# EAGLE design RGB LED 1.1 POV (EAGLE 5.04)
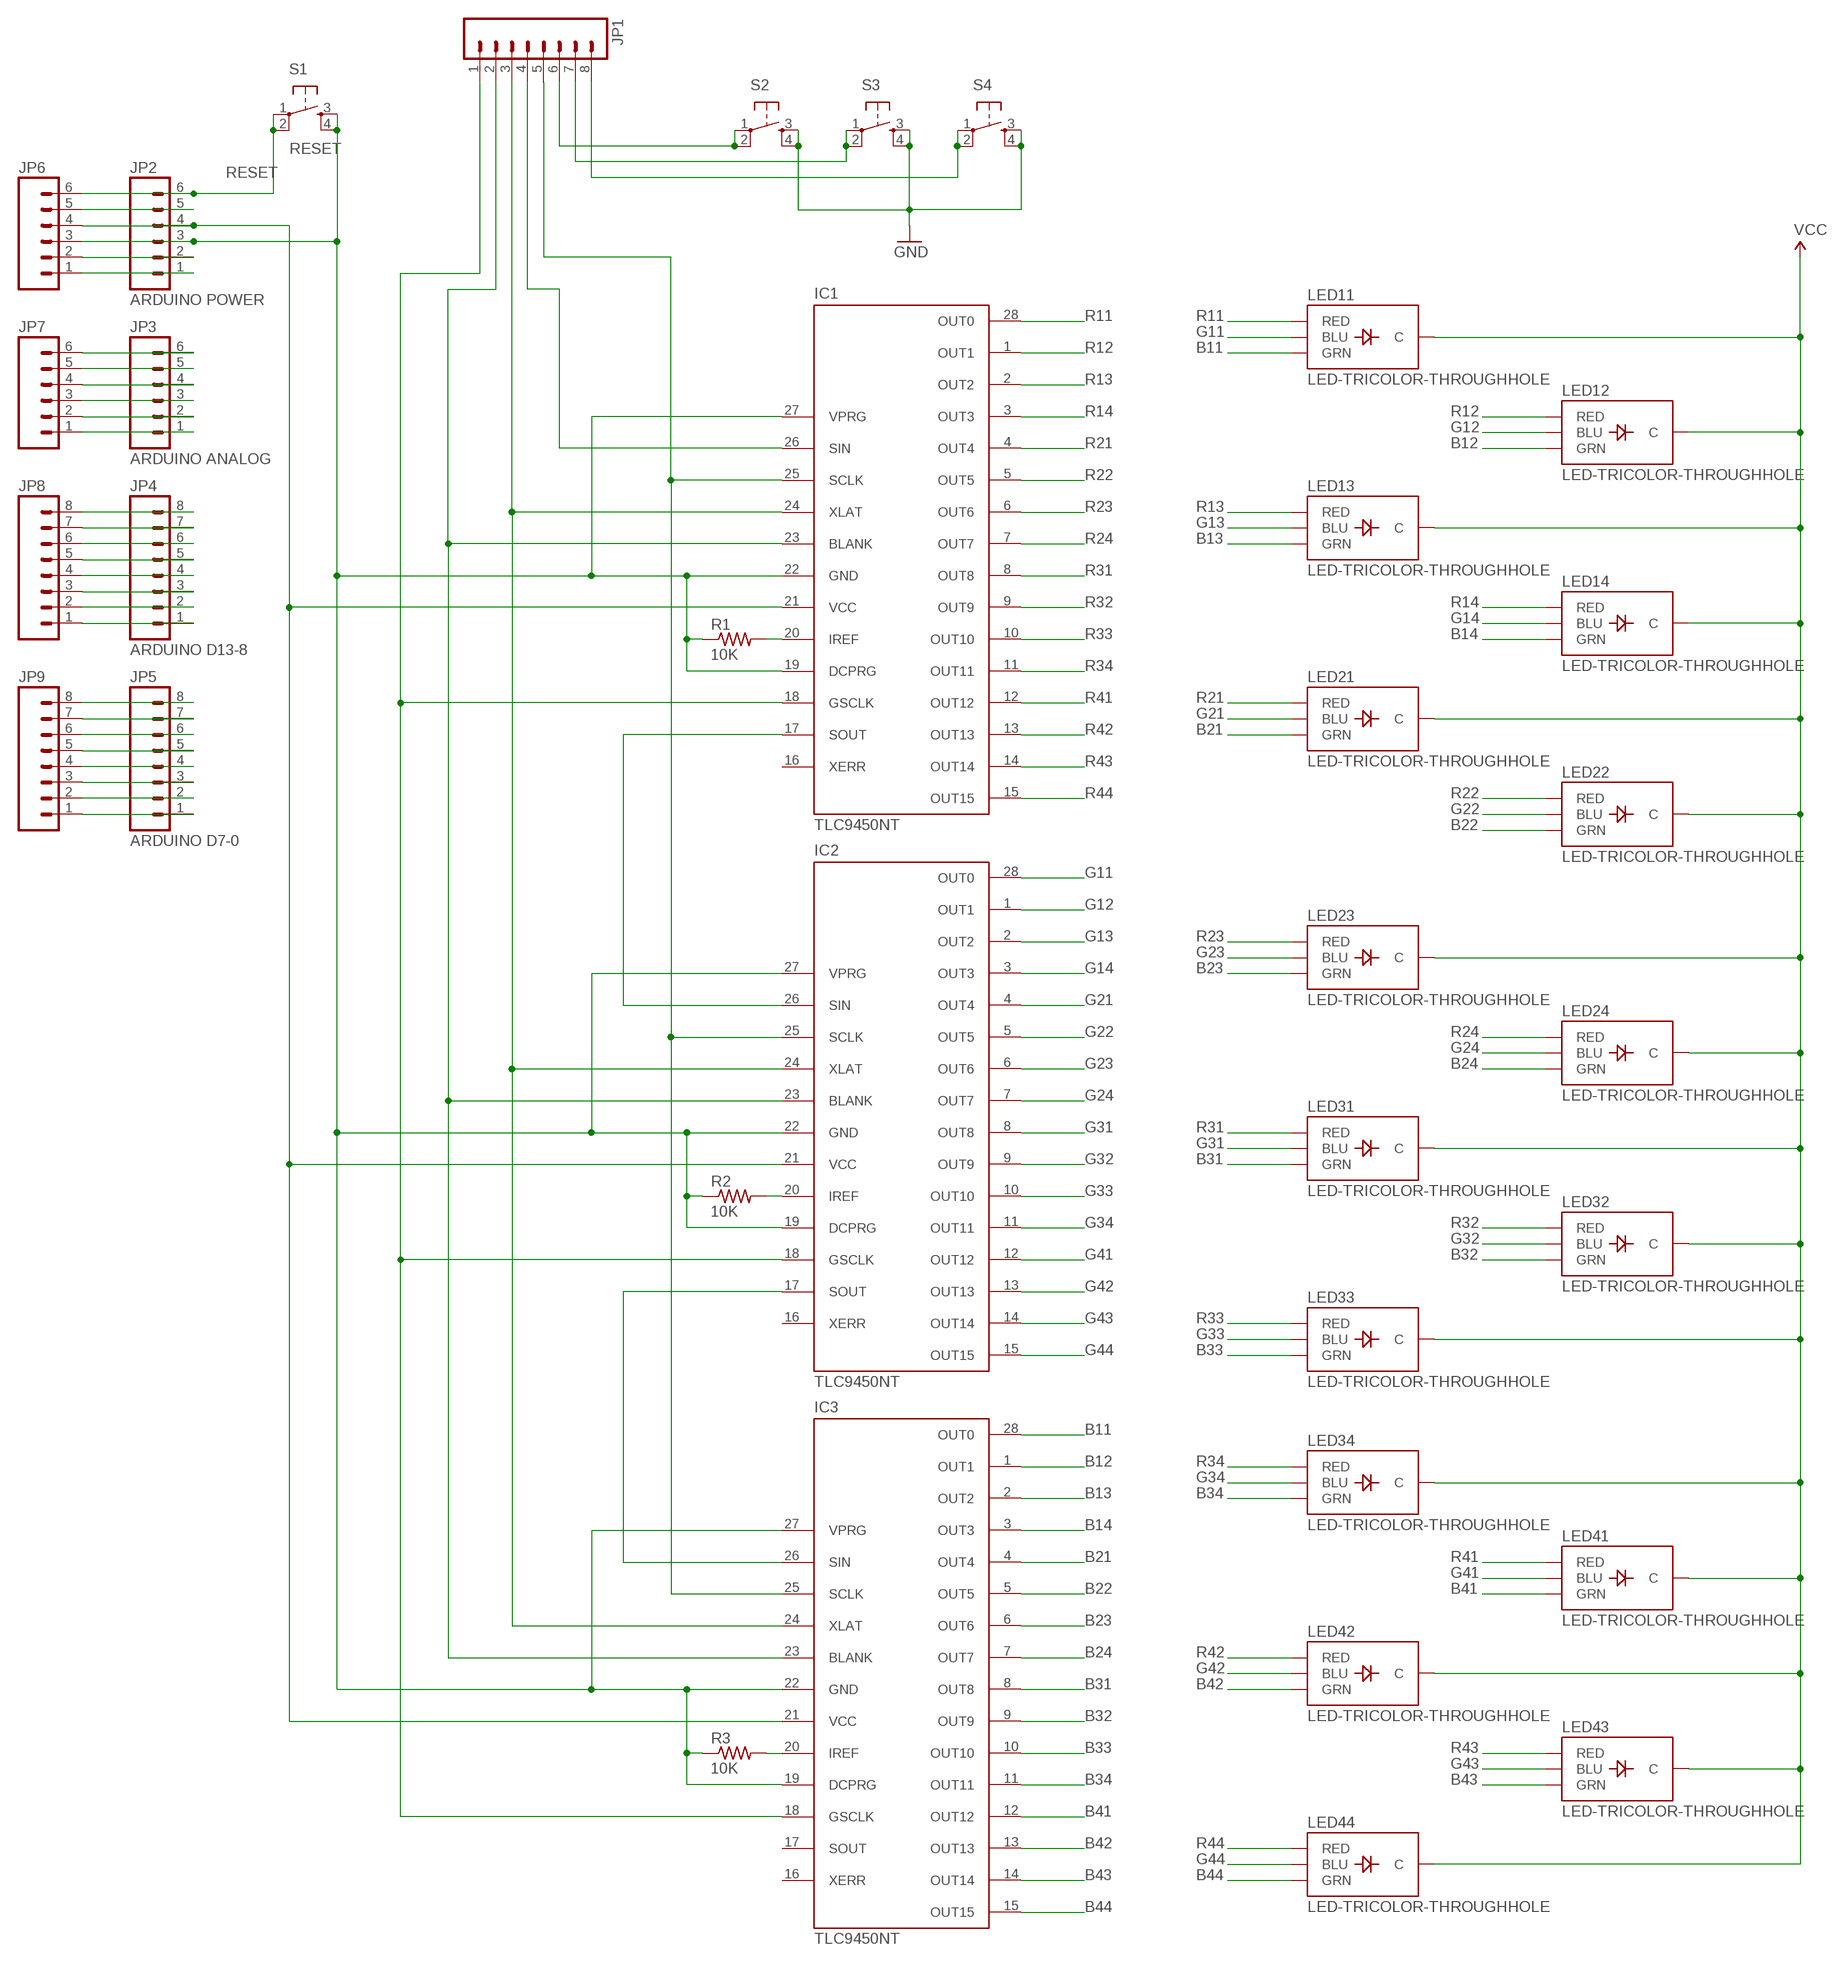
[diagram p0: schematic, sheet 1]

## Parts
IC1  TLC9450NT  [DIL28-3]
IC2  TLC9450NT  [DIL28-3]
IC3  TLC9450NT  [DIL28-3]
JP1  M08LOCK  [1X08_LOCK]
JP2  ARDUINO POWER  M06LOCK  [1X06_LOCK]
JP3  ARDUINO ANALOG  M06LOCK  [1X06_LOCK]
JP4  ARDUINO D13-8  M08LOCK  [1X08_LOCK]
JP5  ARDUINO D7-0  M08LOCK  [1X08_LOCK]
JP6  M06LOCK  [1X06_LOCK]
JP7  M06LOCK  [1X06_LOCK]
JP8  M08LOCK  [1X08_LOCK]
JP9  M08LOCK  [1X08_LOCK]
LED11  LED-TRICOLOR-THROUGHHOLE  [LED-TRICOLOR-THROUGHHOLE]
LED12  LED-TRICOLOR-THROUGHHOLE  [LED-TRICOLOR-THROUGHHOLE]
LED13  LED-TRICOLOR-THROUGHHOLE  [LED-TRICOLOR-THROUGHHOLE]
LED14  LED-TRICOLOR-THROUGHHOLE  [LED-TRICOLOR-THROUGHHOLE]
LED21  LED-TRICOLOR-THROUGHHOLE  [LED-TRICOLOR-THROUGHHOLE]
LED22  LED-TRICOLOR-THROUGHHOLE  [LED-TRICOLOR-THROUGHHOLE]
LED23  LED-TRICOLOR-THROUGHHOLE  [LED-TRICOLOR-THROUGHHOLE]
LED24  LED-TRICOLOR-THROUGHHOLE  [LED-TRICOLOR-THROUGHHOLE]
LED31  LED-TRICOLOR-THROUGHHOLE  [LED-TRICOLOR-THROUGHHOLE]
LED32  LED-TRICOLOR-THROUGHHOLE  [LED-TRICOLOR-THROUGHHOLE]
LED33  LED-TRICOLOR-THROUGHHOLE  [LED-TRICOLOR-THROUGHHOLE]
LED34  LED-TRICOLOR-THROUGHHOLE  [LED-TRICOLOR-THROUGHHOLE]
LED41  LED-TRICOLOR-THROUGHHOLE  [LED-TRICOLOR-THROUGHHOLE]
LED42  LED-TRICOLOR-THROUGHHOLE  [LED-TRICOLOR-THROUGHHOLE]
LED43  LED-TRICOLOR-THROUGHHOLE  [LED-TRICOLOR-THROUGHHOLE]
LED44  LED-TRICOLOR-THROUGHHOLE  [LED-TRICOLOR-THROUGHHOLE]
R1  10K  R-US_0309/12  [0309/12]
R2  10K  R-US_0309/12  [0309/12]
R3  10K  R-US_0309/12  [0309/12]
S1  RESET  TAC_SWITCHPTH  [TACTILE-PTH]
S2  TAC_SWITCHPTH  [TACTILE-PTH]
S3  TAC_SWITCHPTH  [TACTILE-PTH]
S4  TAC_SWITCHPTH  [TACTILE-PTH]

## Nets
B11: IC3.28(OUT0) LED11.GRN
B12: IC3.1(OUT1) LED12.GRN
B13: IC3.2(OUT2) LED13.GRN
B14: IC3.3(OUT3) LED14.GRN
B21: IC3.4(OUT4) LED21.GRN
B22: IC3.5(OUT5) LED22.GRN
B23: IC3.6(OUT6) LED23.GRN
B24: IC3.7(OUT7) LED24.GRN
B31: IC3.8(OUT8) LED31.GRN
B32: IC3.9(OUT9) LED32.GRN
B33: IC3.10(OUT10) LED33.GRN
B34: IC3.11(OUT11) LED34.GRN
B41: IC3.12(OUT12) LED41.GRN
B42: IC3.13(OUT13) LED42.GRN
B43: IC3.14(OUT14) LED43.GRN
B44: IC3.15(OUT15) LED44.GRN
BLANK: IC1.23(BLANK) IC2.23(BLANK) IC3.23(BLANK) JP1.2
G11: IC2.28(OUT0) LED11.BLU
G12: IC2.1(OUT1) LED12.BLU
G13: IC2.2(OUT2) LED13.BLU
G14: IC2.3(OUT3) LED14.BLU
G21: IC2.4(OUT4) LED21.BLU
G22: IC2.5(OUT5) LED22.BLU
G23: IC2.6(OUT6) LED23.BLU
G24: IC2.7(OUT7) LED24.BLU
G31: IC2.8(OUT8) LED31.BLU
G32: IC2.9(OUT9) LED32.BLU
G33: IC2.10(OUT10) LED33.BLU
G34: IC2.11(OUT11) LED34.BLU
G41: IC2.12(OUT12) LED41.BLU
G42: IC2.13(OUT13) LED42.BLU
G43: IC2.14(OUT14) LED43.BLU
G44: IC2.15(OUT15) LED44.BLU
GND: IC1.19(DCPRG) IC1.22(GND) IC1.27(VPRG) IC2.19(DCPRG) IC2.22(GND) IC2.27(VPRG) IC3.19(DCPRG) IC3.22(GND) IC3.27(VPRG) JP2.3 JP6.3 R1.1 R2.1 R3.1 S1.3 S1.4 S2.3 S2.4 S3.3 S3.4 S4.3 S4.4
GSCLK: IC1.18(GSCLK) IC2.18(GSCLK) IC3.18(GSCLK) JP1.1
N$1: IC1.17(SOUT) IC2.26(SIN)
N$2: IC2.17(SOUT) IC3.26(SIN)
N$3: JP1.6 S2.1 S2.2
N$4: IC3.20(IREF) R3.2
N$5: IC2.20(IREF) R2.2
N$6: IC1.20(IREF) R1.2
N$7: JP2.5 JP6.5
N$8: JP2.2 JP6.2
N$9: JP2.1 JP6.1
N$10: JP3.6 JP7.6
N$11: JP3.5 JP7.5
N$12: JP3.4 JP7.4
N$13: JP3.3 JP7.3
N$14: JP3.2 JP7.2
N$15: JP3.1 JP7.1
N$16: JP4.8 JP8.8
N$17: JP4.7 JP8.7
N$18: JP4.6 JP8.6
N$19: JP4.5 JP8.5
N$20: JP4.4 JP8.4
N$21: JP4.3 JP8.3
N$22: JP4.2 JP8.2
N$23: JP4.1 JP8.1
N$24: JP5.8 JP9.8
N$25: JP5.7 JP9.7
N$26: JP5.6 JP9.6
N$27: JP5.5 JP9.5
N$28: JP5.4 JP9.4
N$29: JP5.3 JP9.3
N$30: JP5.2 JP9.2
N$31: JP5.1 JP9.1
N$32: JP1.7 S3.1 S3.2
N$33: JP1.8 S4.1 S4.2
R11: IC1.28(OUT0) LED11.RED
R12: IC1.1(OUT1) LED12.RED
R13: IC1.2(OUT2) LED13.RED
R14: IC1.3(OUT3) LED14.RED
R21: IC1.4(OUT4) LED21.RED
R22: IC1.5(OUT5) LED22.RED
R23: IC1.6(OUT6) LED23.RED
R24: IC1.7(OUT7) LED24.RED
R31: IC1.8(OUT8) LED31.RED
R32: IC1.9(OUT9) LED32.RED
R33: IC1.10(OUT10) LED33.RED
R34: IC1.11(OUT11) LED34.RED
R41: IC1.12(OUT12) LED41.RED
R42: IC1.13(OUT13) LED42.RED
R43: IC1.14(OUT14) LED43.RED
R44: IC1.15(OUT15) LED44.RED
RESET: JP2.6 JP6.6 S1.1 S1.2
SCLK: IC1.25(SCLK) IC2.25(SCLK) IC3.25(SCLK) JP1.5
SIN: IC1.26(SIN) JP1.4
VCC: IC1.21(VCC) IC2.21(VCC) IC3.21(VCC) JP2.4 JP6.4 LED11.GND(C) LED12.GND(C) LED13.GND(C) LED14.GND(C) LED21.GND(C) LED22.GND(C) LED23.GND(C) LED24.GND(C) LED31.GND(C) LED32.GND(C) LED33.GND(C) LED34.GND(C) LED41.GND(C) LED42.GND(C) LED43.GND(C) LED44.GND(C)
XLAT: IC1.24(XLAT) IC2.24(XLAT) IC3.24(XLAT) JP1.3
Unconnected: IC1.16(XERR) IC2.16(XERR) IC3.16(XERR) IC3.17(SOUT)

## Library data of the parts
IC1-IC3 = combee:TLC9450NT: TI TLC5940 16 Channel LED Driver
JP1 JP4 JP5 JP8 JP9 = SparkFun:M08: Header 8 Standard 8-pin 0.1" header. Use with straight break away headers (SKU : PRT-00116), right angle break away headers (PRT-00553), swiss pins (PRT-00743), machine pins (PRT-00117), and female headers (PRT-00115).
JP2 JP3 JP6 JP7 = SparkFun:M06: Header 6 Standard 6-pin 0.1" header. Use with straight break away headers (SKU : PRT-00116), right angle break away headers (PRT-00553), swiss pins (PRT-00743), machine pins (PRT-00117), and female headers (PRT-00115). Molex polarized connector foot print use with SKU : PRT-08094 with associated crimp pins and housings. NOTES ON THE VARIANTS LOCK and LOCK_LONGPADS... This footprint was designed to help hold the alignment of a through-hole component (i.e. 6-pin header) while soldering it into place. You may notice that each hole has been shifted either up or down by 0.005 of an inch from it's more standard position (which is a perfectly straight line). This slight alteration caused the pins (the squares in the middle) to touch the edges of the holes. Because they are alternating, it causes a "brace" to hold the component in place. 0.005 has proven to be the perfect amount of "off-center" position when using our standard breakaway headers. Although looks a little odd when you look at the bare footprint, once you have a header in there, the alteration is very hard to notice. Also, if you push a header all the way into place, it is covered up entirely on the bottom side. This idea of altering the position of holes to aid alignment will be further integrated into the Sparkfun Library for other footprints. It can help hold any component with 3 or more connection pins.
LED11-LED14 LED21-LED24 LED31-LED34 LED41-LED44 = SparkFun:LED-TRICOLOR-THROUGHHOLE
R1-R3 = resistor:R-US_: RESISTOR, American symbol
S1-S4 = SparkFun:TAC_SWITCH: Momentary Switch Button commonly used for reset or general input. Spark Fun Electronics SKU : COM-00097

## Board
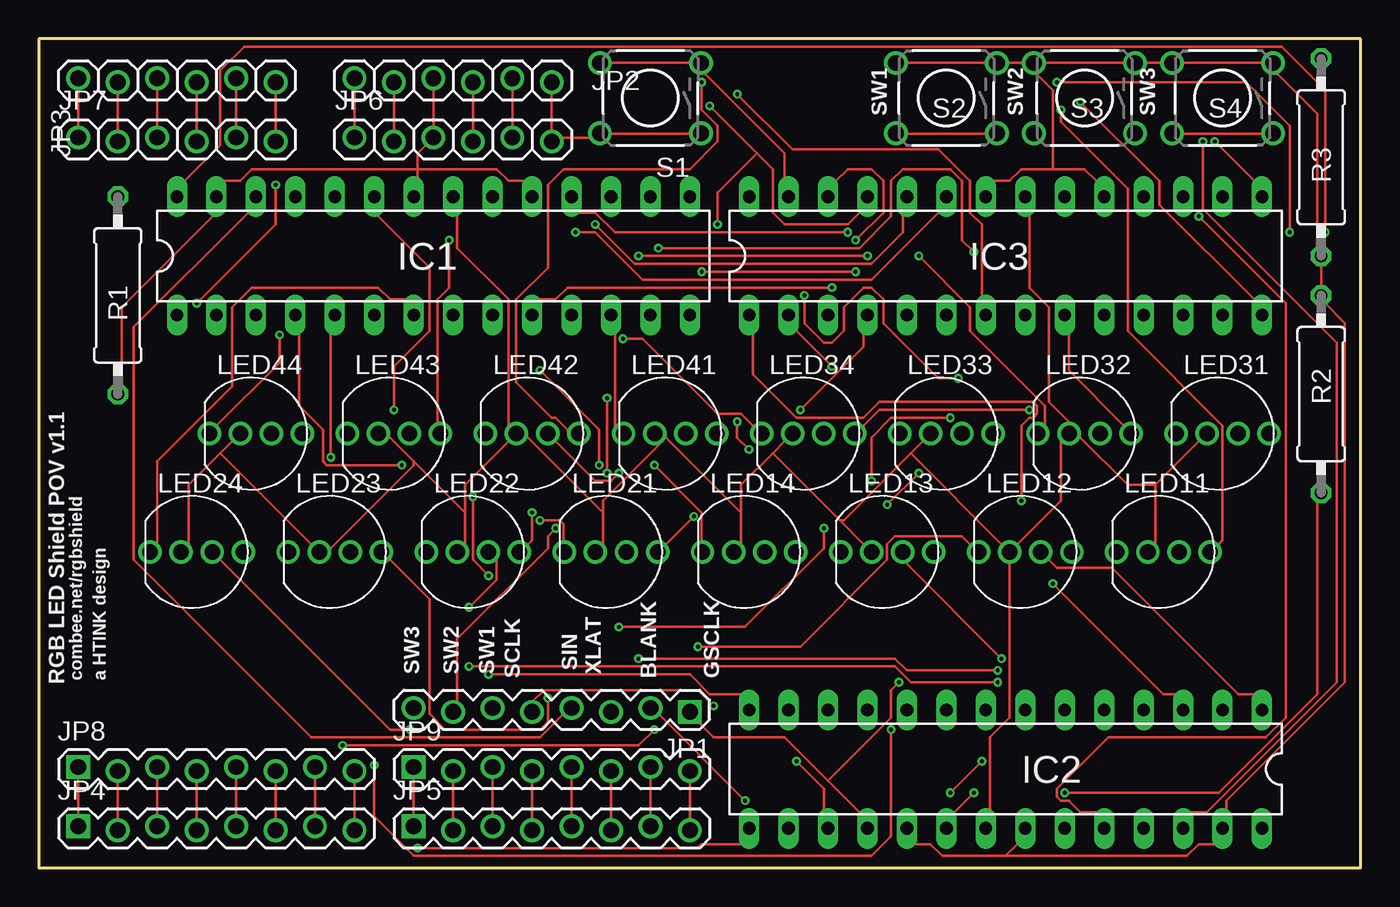
[diagram p1: board, top side]
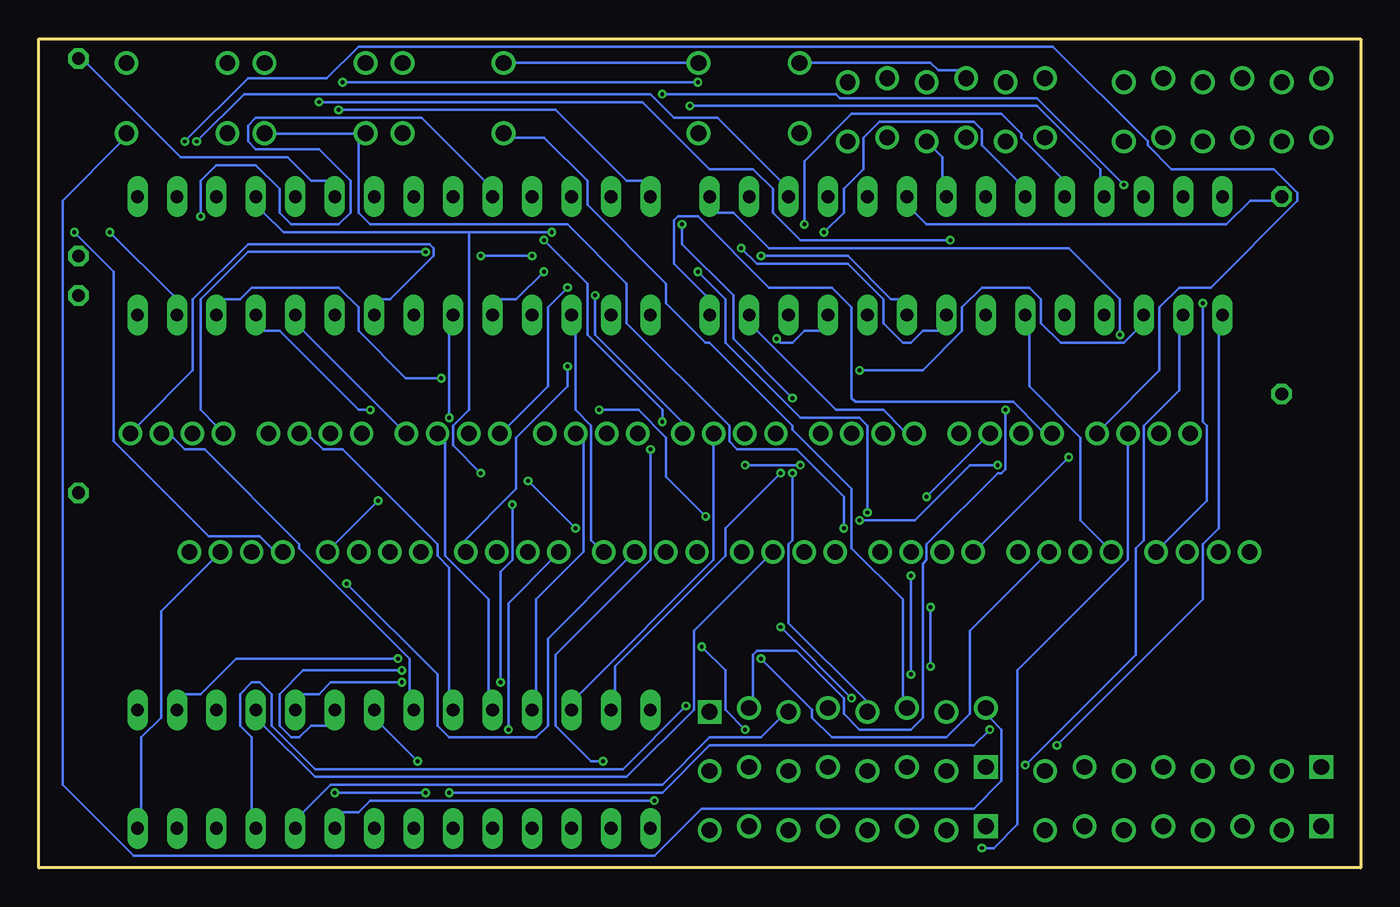
[diagram p2: board, bottom side, seen from below]

Size 85.09 x 53.34 mm. Coordinates in mm from the lower left corner, seen from the top.
Outline: 0,0 85.09,0 85.09,53.34 0,53.34 0,0
Copper layers (1*16): Top 0.035mm / dielectric 1.5mm / Bottom 0.035mm
Design rules "PropagandaPCB": minimum track width 6mil, minimum drill 10mil, track to track 6mil, track to pad 6mil, pad to pad 6mil, via to via 6mil, smd to smd 6mil, copper to edge 10mil, drill to drill 10mil, minimum pad ring 10mil, minimum via ring 6mil, stop-mask expansion 2mil, vias tented up to drill 100mil, thermal gap 10mil

### Footprints (pad centres in the part's own frame; a part is rotated, then mirrored left to right if it is on the bottom)
DIL28-3 = drill 0.813 long: 1 -16.51,-3.81; 2 -13.97,-3.81; 3 -11.43,-3.81; 4 -8.89,-3.81; 5 -6.35,-3.81; 6 -3.81,-3.81; 7 -1.27,-3.81; 8 1.27,-3.81; 9 3.81,-3.81; 10 6.35,-3.81; 11 8.89,-3.81; 12 11.43,-3.81; 13 13.97,-3.81; 14 16.51,-3.81; 15 16.51,3.81; 16 13.97,3.81; 17 11.43,3.81; 18 8.89,3.81; 19 6.35,3.81; 20 3.81,3.81; 21 1.27,3.81; 22 -1.27,3.81; 23 -3.81,3.81; 24 -6.35,3.81; 25 -8.89,3.81; 26 -11.43,3.81; 27 -13.97,3.81; 28 -16.51,3.81
1X08_LOCK = drill 1.016 square: 1 0,0.127 | drill 1.016 round: 2 2.54,-0.127; 3 5.08,0.127; 4 7.62,-0.127; 5 10.16,0.127; 6 12.7,-0.127; 7 15.24,0.127; 8 17.78,-0.127
1X06_LOCK = drill 1.016 round: 1 0,0; 2 2.54,-0.254; 3 5.08,0; 4 7.62,-0.254; 5 10.16,0; 6 12.7,-0.254
LED-TRICOLOR-THROUGHHOLE = drill 1 round: BLU 1,0; GND -1,0; GRN 3,0; RED -3,0
0309/12 = drill 0.813 octagon: 1 -6.35,0; 2 6.35,0
TACTILE-PTH = drill 1.016 round: 1 -3.251,2.261; 2 3.251,2.261; 3 -3.251,-2.261; 4 3.251,-2.261

### Placement (x,y rotation side)
IC1  25.4,39.37 0 top
IC2  62.23,6.35 180 top
IC3  62.23,39.37 0 top
JP1  41.91,10.16 180 top
JP2  20.32,50.8 0 top
JP3  2.54,50.8 0 top
JP4  2.54,2.54 0 top
JP5  24.13,2.54 0 top
JP6  20.32,46.99 0 top
JP7  2.54,46.99 0 top
JP8  2.54,6.35 0 top
JP9  24.13,6.35 0 top
LED11  72.39,20.32 0 top
LED12  63.5,20.32 0 top
LED13  54.61,20.32 0 top
LED14  45.72,20.32 0 top
LED21  36.83,20.32 0 top
LED22  27.94,20.32 0 top
LED23  19.05,20.32 0 top
LED24  10.16,20.32 0 top
LED31  76.2,27.94 0 top
LED32  67.31,27.94 0 top
LED33  58.42,27.94 0 top
LED34  49.53,27.94 0 top
LED41  40.64,27.94 0 top
LED42  31.75,27.94 0 top
LED43  22.86,27.94 0 top
LED44  13.97,27.94 0 top
R1  5.08,36.83 90 top
R2  82.55,30.48 270 top
R3  82.55,45.72 90 top
S1  39.37,49.53 180 top
S2  58.42,49.53 180 top
S3  67.31,49.53 180 top
S4  76.2,49.53 180 top

### Tracks (layer width: path | path; a pad name or v marks a point on that pad's centre or on a via)
B11  (via drill 0.25)
  Top 0.152: v65.79,48.77 65.79,48.01 70.1,43.69 70.1,34.54 76.2,28.45 76.2,21.08 75.95,20.83 LED11.GRN
  Bottom 0.152: v65.79,48.77 51.82,48.77 47.24,44.2 46.23,44.2 IC3.28
B12  (via drill 0.25)
  Top 0.152: v63.25,23.62 63.25,28.45 63.75,28.96 64.01,28.96 64.26,29.21 64.26,29.72 64.01,29.97 54.1,29.97 53.09,28.96 48.77,28.96 45.97,31.75 45.97,34.29 IC3.1
  Bottom 0.152: v63.25,23.62 66.04,20.83 LED12.GRN
B13  (via drill 0.25)
  Top 0.152: v51.05,32.26 48.77,34.54 IC3.2
  Bottom 0.152: v51.05,32.26 51.05,30.99 54.36,27.69 54.36,24.38 57.91,20.83 LED13.GRN
B14
  Bottom 0.152: IC3.3 50.55,34.29 50.55,29.46 49.53,28.45 49.53,21.08 49.28,20.83 LED14.GRN
B21  (via drill 0.25)
  Top 0.152: v49.02,29.46 53.09,33.53 53.09,34.29 IC3.4 | v42.16,22.61 40.39,20.83 LED21.GRN
  Bottom 0.152: v49.02,29.46 46.48,29.46 44.7,27.69 44.7,25.15 v42.16,22.61
B22  (via drill 0.25)
  Top 0.152: v42.67,38.35 v52.58,38.35 | v31.75,22.86 31.75,21.08 31.5,20.83 LED22.GRN
  Bottom 0.152: v52.58,38.35 54.36,36.58 55.37,36.58 IC3.5 | v42.67,38.35 40.89,36.58 40.89,33.78 36.07,28.96 32.26,28.96 31.75,28.45 v31.75,22.86
B23  (via drill 0.25)
  Top 0.152: v58.67,28.96 54.86,28.96 53.59,27.69 v53.59,24.89 | v50.55,21.84 50.55,20.57 45.47,15.49 v37.34,15.49 | v32.77,10.92 32.77,9.4 32.26,8.89 26.16,8.89 25.15,9.91 25.15,17.27 22.61,19.81 LED23.GRN
  Bottom 0.152: v58.67,28.96 58.67,34.29 IC3.6 | v50.55,21.84 v53.59,24.89 | v32.77,10.92 v37.34,15.49
B24  (via drill 0.25)
  Top 0.152: v44.96,49.78 48.51,46.23 57.91,46.23 59.94,44.2 59.94,42.16 60.71,41.4 60.71,36.83 IC3.7 | v15.24,43.94 15.24,41.4 v10.16,36.32
  Bottom 0.152: v44.96,49.78 33.78,49.78 33.53,49.53 20.83,49.53 v15.24,43.94 | v10.16,36.32 10.16,28.7 9.91,28.45 9.91,23.62 12.7,20.83 LED24.GRN
B31
  Bottom 0.152: IC3.8 62.99,36.58 62.48,36.58 59.69,39.37 59.69,39.88 59.94,40.13 71.63,40.13 75.18,36.58 75.18,32 78.74,28.45 LED31.GRN
B32
  Top 0.152: IC3.9 66.29,34.29 66.29,32 69.85,28.45 LED32.GRN
B33
  Bottom 0.152: IC3.10 68.07,34.54 61.98,28.45 LED33.GRN
B34  (via drill 0.25)
  Top 0.152: v63.75,29.46 54.1,29.46 53.09,28.45 LED34.GRN
  Bottom 0.152: v63.75,29.46 64.52,29.46 69.6,34.54 70.61,34.54 IC3.11
B41  (via drill 0.25)
  Top 0.152: v59.18,31.5 57.91,31.5 54.36,35.05 54.36,36.58 53.59,37.34 53.09,37.34 51.82,36.07 51.82,34.54 51.05,33.78 50.55,33.78 49.28,35.05 v49.28,36.83
  Bottom 0.152: v59.18,31.5 61.47,31.5 64.52,34.54 64.52,36.07 65.79,37.34 71.37,37.34 72.14,36.58 73.15,36.58 IC3.12 | v49.28,36.83 49.28,34.29 43.43,28.45 LED41.GRN
B42  (via drill 0.25)
  Top 0.152: v80.52,40.89 80.52,47.75 77.72,50.55 v65.53,50.55 | v42.67,50.55 42.67,48.77 43.69,47.75 43.69,46.74 41.91,44.96 33.78,44.96 32.77,43.94 32.77,38.61 30.73,36.58 30.73,31.24 33.02,28.96 33.27,28.96 34.04,28.19 LED42.GRN
  Bottom 0.152: v80.52,40.89 76.45,36.83 IC3.13 | v42.67,50.55 v65.53,50.55
B43  (via drill 0.25)
  Top 0.152: v67.06,49.28 72.14,44.2 72.14,42.67 78.23,36.58 IC3.14 | v26.42,40.39 26.42,37.34 25.65,36.58 25.65,28.45 LED43.GRN
  Bottom 0.152: v67.06,49.28 46.23,49.28 41.91,44.96 39.12,44.96 37.85,43.69 37.85,42.16 36.07,40.39 v26.42,40.39
B44  (via drill 0.25)
  Top 0.152: v75.69,46.74 78.23,44.2 IC3.15
  Bottom 0.152: v75.69,46.74 71.63,50.8 66.55,50.8 64.52,52.83 19.81,52.83 13.72,46.74 13.72,46.48 12.19,44.96 5.59,44.96 4.06,43.43 4.06,42.93 9.65,37.34 11.68,37.34 12.95,36.07 12.95,32 16.51,28.45 LED44.GRN
BLANK  (via drill 0.25)
  Top 0.152: v45.47,4.32 39.88,9.91 JP1.2 | v34.54,40.89 35.81,40.89 38.86,37.85 53.59,37.85 57.91,42.16 IC3.23 | v22.86,29.46 22.86,32.26 25.15,34.54 25.15,38.61 21.84,41.91 IC1.23
  Bottom 0.152: v45.47,4.32 63.75,4.32 64.52,3.56 65.53,3.56 IC2.23 | v34.54,40.89 33.27,42.16 33.27,43.69 32,44.96 32,46.99 30.99,48.01 24.89,48.01 24.38,47.5 24.38,46.48 22.1,44.2 IC1.23 | v22.86,29.46 22.86,25.65 23.11,25.4 23.37,25.4 27.94,20.83 27.94,19.81 28.19,19.56 28.19,9.65 28.96,8.89 32.26,8.89 33.27,9.91 33.27,10.92 36.32,13.97 38.86,13.97 39.12,13.72 39.12,10.92 JP1.2
G11
  Bottom 0.152: IC2.28 78.49,3.81 78.49,8.38 77.22,9.65 77.22,16.51 73.91,19.81 LED11.BLU
G12
  Top 0.152: IC2.1 78.23,11.18 77.22,11.18 69.09,19.3 65.53,19.3 65.02,19.81 LED12.BLU
G13  (via drill 0.25)
  Top 0.152: v61.98,13.46 55.63,19.81 LED13.BLU
  Bottom 0.152: v61.98,13.46 72.39,13.46 74.68,11.18 75.69,11.18 IC2.2
G14  (via drill 0.25)
  Top 0.152: v65.28,18.29 72.39,11.18 73.15,11.18 IC2.3
  Bottom 0.152: v65.28,18.29 59.44,12.45 59.44,9.14 58.67,8.38 53.09,8.38 52.32,9.14 52.32,14.73 47.24,19.81 LED14.BLU
G21
  Bottom 0.152: IC2.4 70.61,9.14 67.31,5.84 47.24,5.84 42.93,10.16 42.93,15.24 38.35,19.81 LED21.BLU
G22  (via drill 0.25)
  Top 0.152: v61.72,11.94 56.13,11.94 55.12,12.95 v27.69,12.95 | v27.69,16.76 29.46,18.54 29.46,19.81 LED22.BLU
  Bottom 0.152: v61.72,11.94 66.29,11.94 67.06,11.18 68.07,11.18 IC2.5 | v27.69,12.95 v27.69,16.76
G23  (via drill 0.25)
  Top 0.152: v61.72,12.7 55.88,12.7 55.12,13.46 v38.61,13.46
  Bottom 0.152: v61.72,12.7 68.07,12.7 69.6,11.18 69.6,9.14 68.83,8.38 68.33,8.38 67.56,9.14 66.55,9.14 IC2.6 | v38.61,13.46 35.31,10.16 35.31,9.65 34.04,8.38 26.67,8.38 25.15,9.91 25.15,15.24 20.57,19.81 LED23.BLU
G24  (via drill 0.25)
  Top 0.152: v58.67,4.83 v60.71,6.86 | v23.88,8.89 22.61,8.89 11.68,19.81 LED24.BLU
  Bottom 0.152: v60.71,6.86 62.99,9.14 IC2.7 | v58.67,4.83 44.96,4.83 41.91,7.87 24.89,7.87 v23.88,8.89
G31
  Bottom 0.152: IC2.8 61.21,11.43 61.21,13.46 68.33,20.57 68.33,20.83 74.42,26.92 75.69,26.92 76.45,27.69 LED31.BLU
G32
  Bottom 0.152: IC2.9 58.67,11.43 58.67,19.3 59.44,20.07 59.44,20.83 65.53,26.92 66.8,26.92 67.56,27.69 LED32.BLU
G33
  Bottom 0.152: IC2.10 56.13,11.43 56.13,17.27 58.93,20.07 58.93,27.43 LED33.BLU
G34
  Bottom 0.152: IC2.11 53.09,11.43 53.09,17.27 50.04,20.32 50.04,27.43 LED34.BLU
G41
  Bottom 0.152: IC2.12 50.29,11.18 41.66,19.81 41.66,27.43 LED41.BLU
G42  (via drill 0.25)
  Top 0.152: v37.34,25.4 36.83,24.89 35.81,24.89 33.27,27.43 LED42.BLU
  Bottom 0.152: v37.34,25.4 40.89,21.84 40.89,20.07 48.01,12.95 48.01,11.43 IC2.13
G43  (via drill 0.25)
  Top 0.152: v28.96,12.45 41.91,12.45 43.18,11.18 45.21,11.18 IC2.14 | v28.96,18.8 27.94,19.81 v27.94,23.88
  Bottom 0.152: v28.96,12.45 v28.96,18.8 | v27.94,23.88 24.38,27.43 LED43.BLU
G44  (via drill 0.25)
  Top 0.152: v24.38,1.27 42.42,1.27 42.67,1.52 45.21,1.52 IC2.15
  Bottom 0.152: v24.38,1.27 23.62,1.27 22.1,2.79 22.1,12.7 14.99,19.81 14.99,27.43 LED44.BLU
GND
  Top 0.152: R1.1 5.33,30.99 5.33,36.07 11.18,41.91 IC1.27 11.94,44.2 12.95,44.2 13.72,44.96 24.38,44.96 | 24.38,44.96 24.38,45.97 JP6.3 JP2.3 | 24.38,44.96 24.38,44.45 IC1.22 | 24.38,44.96 29.46,44.96 30.23,44.2 31.24,44.2 IC1.19 | IC3.27 48.01,44.45 48.01,45.97 42.93,51.05 S1.3 41.91,51.82 36.83,51.82 S1.4 | 65.28,44.96 67.31,44.96 68.07,44.2 IC3.19 | 65.28,44.96 63.25,44.96 62.48,44.2 61.47,44.2 IC3.22 | S2.4 55.88,51.82 60.96,51.82 S2.3 62.23,51.82 63.5,51.82 S3.4 | 65.28,44.96 65.28,50.04 64.26,51.05 S3.4 | 62.23,0.76 58.17,0.76 57.4,1.52 56.39,1.52 IC2.19 | 62.23,0.76 62.99,1.52 IC2.22 | 62.23,0.76 73.91,0.76 74.68,1.52 75.69,1.52 IC2.27 76.45,3.81 76.45,4.32 84.07,11.94 84.07,35.05 82.8,36.32 R2.1 R3.1 82.3,39.88 82.3,48.51 79.76,51.05 S4.3 78.74,51.82 73.66,51.82 S4.4 72.39,51.82 71.12,51.82 S3.3 69.85,51.82 64.77,51.82 S3.4
  Bottom 0.152: JP2.3 25.91,51.31 27.18,51.31 27.69,51.82 35.56,51.82 S1.4 | S1.3 43.18,51.82 54.61,51.82 S2.4
GSCLK  (via drill 0.25)
  Top 0.152: 50.8,5.59 48.01,8.38 43.43,8.38 42.42,9.4 JP1.1 | 50.8,5.59 52.83,3.56 IC2.18 | v52.07,40.89 37.08,40.89 35.81,42.16 34.8,42.16 IC1.18 | 50.8,5.59 54.86,9.65 54.86,11.43 v55.37,11.94 | v54.61,23.37 v56.64,25.4
  Bottom 0.152: 57.4,40.89 69.34,40.89 70.61,42.16 IC3.18 | 57.4,40.89 v52.07,40.89 | v55.37,11.94 55.37,19.05 54.61,19.81 v54.61,23.37 | v56.64,25.4 58.42,27.18 58.42,28.45 57.4,29.46 57.4,40.89
N$1  (via drill 0.25)
  Top 0.152: v74.93,46.74 74.93,42.42 83.57,33.78 83.57,11.94 75.18,3.56 74.17,3.56 IC2.26
  Bottom 0.152: v74.93,46.74 71.88,49.78 45.72,49.78 44.2,48.26 41.4,48.26 37.34,44.2 IC1.17
N$2  (via drill 0.25)
  Top 0.152: v48.77,6.86 50.55,5.08 50.55,3.81 IC2.17 | v45.72,26.92 44.96,27.69 v44.96,28.7 | v52.58,40.39 54.36,42.16 54.36,44.2 53.59,44.96 52.07,44.96 51.31,44.2 IC3.26
  Bottom 0.152: v48.77,6.86 49.53,6.86 51.82,9.14 51.82,13.72 45.72,19.81 v45.72,26.92 | v44.96,28.7 44.96,29.46 49.78,34.29 49.78,37.59 v52.58,40.39
N$3
  Top 0.152: S2.1 60.96,47.24 55.88,47.24 S2.2
  Bottom 0.152: JP1.6 29.46,10.92 29.46,17.27 32.77,20.57 32.77,24.38 36.58,28.19 36.58,28.45 41.91,33.78 42.16,33.78 44.7,36.32 44.7,37.59 49.78,42.67 49.78,44.2 52.58,46.99 54.61,46.99 S2.2
N$4
  Bottom 0.152: IC3.20 66.55,44.2 67.56,44.2 69.09,45.72 75.95,45.72 82.04,51.82 R3.2
N$5  (via drill 0.25)
  Top 0.152: v60.2,4.83 58.93,3.56 IC2.20 | v66.04,4.83 75.95,4.83 82.3,11.18 82.3,23.62 R2.2
  Bottom 0.152: v60.2,4.83 v66.04,4.83
N$6
  Bottom 0.152: R1.2 5.59,42.93 7.11,42.93 8.64,41.4 27.94,41.4 28.7,42.16 IC1.20
N$7
  Top 0.152: JP6.5 JP2.5
N$8
  Top 0.152: JP6.2 JP2.2
N$9
  Top 0.152: JP6.1 JP2.1
N$10
  Top 0.152: JP7.6 JP3.6
N$11
  Top 0.152: JP7.5 JP3.5
N$12
  Top 0.152: JP7.4 JP3.4
N$13
  Top 0.152: JP7.3 JP3.3
N$14
  Top 0.152: JP7.2 JP3.2
N$15
  Top 0.152: JP7.1 JP3.1
N$16
  Top 0.152: JP4.8 JP8.8
N$17
  Top 0.152: JP4.7 JP8.7
N$18
  Top 0.152: JP4.6 JP8.6
N$19
  Top 0.152: JP4.5 JP8.5
N$20
  Top 0.152: JP4.4 JP8.4
N$21
  Top 0.152: JP4.3 JP8.3
N$22
  Top 0.152: JP4.2 JP8.2
N$23
  Top 0.152: JP4.1 JP8.1
N$24
  Top 0.152: JP5.8 JP9.8
N$25
  Top 0.152: JP5.7 JP9.7
N$26
  Top 0.152: JP5.6 JP9.6
N$27
  Top 0.152: JP5.5 JP9.5
N$28
  Top 0.152: JP5.4 JP9.4
N$29
  Top 0.152: JP5.3 JP9.3
N$30
  Top 0.152: JP5.2 JP9.2
N$31
  Top 0.152: JP5.1 JP9.1
N$32  (via drill 0.25)
  Top 0.152: v33.27,21.84 32.77,21.34 32.77,20.57 26.92,14.73 26.92,10.67 JP1.7
  Bottom 0.152: v33.27,21.84 33.27,23.88 36.32,26.92 40.13,26.92 40.64,27.43 40.64,28.45 47.24,35.05 47.24,37.59 51.05,41.4 63.75,41.4 64.52,42.16 64.52,46.74 S3.2 64.77,47.24 69.85,47.24 S3.1
N$33
  Top 0.152: S4.2 73.66,47.24 78.74,47.24 S4.1
  Bottom 0.152: JP1.8 23.88,9.65 23.11,8.89 23.11,5.59 24.89,3.81 42.42,3.81 45.47,0.76 78.99,0.76 83.57,5.33 83.57,42.93 79.76,46.74 S4.1
R11  (via drill 0.25)
  Top 0.152: v82.8,40.89 82.8,50.04 80.01,52.83 13.21,52.83 11.68,51.31 11.68,46.48 9.4,44.2 IC1.28
  Bottom 0.152: v82.8,40.89 80.26,38.35 80.26,27.43 74.17,21.34 70.87,21.34 70.1,20.57 LED11.RED
R12  (via drill 0.25)
  Top 0.152: v19.56,7.87 38.61,7.87 v39.62,8.89 | v42.42,14.22 49.02,14.22 54.61,19.81 54.61,20.83 55.12,21.34 59.44,21.34 59.94,20.83 LED12.RED
  Bottom 0.152: v19.56,7.87 10.16,17.27 10.16,20.83 9.14,21.84 9.14,34.29 IC1.1 | v39.62,8.89 40.89,10.16 40.89,12.7 v42.42,14.22
R13  (via drill 0.25)
  Top 0.152: v21.59,6.6 21.59,3.3 24.13,0.76 53.59,0.76 54.86,2.03 v54.86,8.89
  Bottom 0.152: v21.59,6.6 14.48,13.72 14.48,20.57 13.97,21.08 13.97,28.45 11.68,30.73 11.68,34.29 IC1.2 | v54.86,8.89 54.86,17.02 52.07,19.81 LED13.RED
R14  (via drill 0.25)
  Top 0.152: v32.26,32 36.07,28.19 v36.07,25.91 | v39.62,25.91 42.67,22.86 42.67,20.83 LED14.RED
  Bottom 0.152: v32.26,32 28.19,32 25.65,34.54 25.65,36.07 24.38,37.34 21.34,37.34 20.57,36.58 20.57,35.05 19.3,33.78 15.24,33.78 14.48,34.54 IC1.3 | v36.07,25.91 v39.62,25.91
R21  (via drill 0.25)
  Top 0.152: v23.37,25.91 18.54,25.91 18.29,26.16 18.29,28.19 16.76,29.72 16.76,34.29 IC1.4 | v32.26,22.35 33.53,22.35 33.78,22.1 33.78,20.83 LED21.RED
  Bottom 0.152: v23.37,25.91 25.15,25.91 28.7,22.35 v32.26,22.35
R22  (via drill 0.25)
  Top 0.152: v18.8,26.42 18.8,34.29 IC1.5
  Bottom 0.152: v18.8,26.42 24.38,20.83 LED22.RED
R23
  Bottom 0.152: IC1.6 21.34,34.29 21.34,30.99 18.03,27.69 18.03,22.35 16.51,20.83 LED23.RED
R24
  Top 0.152: IC1.7 23.62,36.58 22.61,36.58 21.84,37.34 13.72,37.34 12.45,36.07 12.45,30.99 7.62,26.16 7.62,20.83 LED24.RED
R31  (via drill 0.25)
  Top 0.152: v39.88,39.88 52.83,39.88 54.86,41.91 54.86,44.2 55.63,44.96 58.67,44.96 59.44,44.2 59.44,40.39 v60.2,39.62
  Bottom 0.152: v39.88,39.88 38.86,38.86 33.02,38.86 30.73,36.58 30.73,35.05 29.46,33.78 28.96,33.78 28.19,34.54 27.18,34.54 IC1.8 | v60.2,39.62 71.63,39.62 74.68,36.58 74.68,29.46 73.66,28.45 LED31.RED
R32  (via drill 0.25)
  Top 0.152: v38.61,39.37 v53.34,39.37 | v56.64,39.37 59.94,36.07 59.94,34.54 64.77,29.72 64.77,28.45 LED32.RED
  Bottom 0.152: v38.61,39.37 33.02,39.37 30.23,36.58 29.72,36.58 IC1.9 | v53.34,39.37 v56.64,39.37
R33  (via drill 0.25)
  Top 0.152: v51.05,37.34 34.04,37.34 33.27,36.58 32.26,36.58 IC1.10
  Bottom 0.152: v51.05,37.34 52.32,36.07 52.32,30.99 54.86,28.45 LED33.RED
R34  (via drill 0.25)
  Top 0.152: v37.59,34.04 38.86,34.04 43.69,29.21 45.21,29.21 45.97,28.45 LED34.RED
  Bottom 0.152: v37.59,34.04 37.34,33.78 36.58,33.78 35.81,34.54 34.8,34.54 IC1.11
R41
  Top 0.152: IC1.12 37.08,34.29 37.08,28.45 LED41.RED
R42
  Bottom 0.152: IC1.13 38.86,34.54 33.78,29.46 30.73,29.46 29.46,28.19 LED42.RED
R43
  Bottom 0.152: IC1.14 42.16,36.83 44.2,38.86 44.2,41.66 43.94,41.91 42.67,41.91 38.1,37.34 34.04,37.34 32.77,36.07 32.77,30.23 32.51,29.97 22.35,29.97 20.57,28.19 LED43.RED
R44  (via drill 0.25)
  Top 0.152: v15.49,34.29 15.49,32.51 11.43,28.45 LED44.RED
  Bottom 0.152: v15.49,34.29 15.49,36.58 18.8,39.88 38.1,39.88 40.39,42.16 41.4,42.16 IC1.15
RESET
  Top 0.152: JP2.6 JP6.6 33.53,46.99 35.56,46.99 S1.2 36.83,47.24 41.91,47.24 S1.1
SCLK  (via drill 0.25)
  Top 0.152: 46.23,45.97 47.24,44.96 47.24,42.16 48.01,41.4 52.07,41.4 52.83,42.16 IC3.25 | 46.23,45.97 v43.18,49.02 | v43.43,10.41 42.42,11.43 32.51,11.43 31.75,10.67 JP1.5 | 46.23,45.97 43.69,43.43 v43.69,41.4 | v36.58,25.4 v36.58,30.23
  Bottom 0.152: v43.18,49.02 20.83,49.02 16.76,44.96 16.76,44.45 IC1.25 | v43.43,10.41 47.5,6.35 67.31,6.35 70.1,9.14 70.1,11.18 70.87,11.94 71.37,11.94 72.14,11.18 72.14,9.14 71.37,8.38 71.37,3.81 IC2.25 | v43.69,41.4 43.69,40.13 40.39,36.83 40.39,34.04 v36.58,30.23 | v36.58,25.4 36.58,21.08 36.83,20.83 36.83,15.75 31.75,10.67 JP1.5
SIN
  Top 0.152: IC1.26 13.46,42.16 6.1,34.8 6.1,19.81 17.53,8.38 32.26,8.38 33.78,9.91 JP1.4
VCC
  Top 0.152: 11.68,26.67 12.45,27.43 LED44.GND | 11.68,26.67 9.65,24.64 9.65,20.83 LED24.GND | 11.68,26.67 17.53,20.83 LED23.GND 18.8,20.57 24.13,25.91 24.13,26.16 | JP6.4 JP2.4 | 27.43,22.86 27.43,24.64 30.23,27.43 LED42.GND | 27.43,22.86 27.43,20.83 LED22.GND | 24.13,26.16 27.43,22.86 | 24.13,26.16 22.61,27.69 LED43.GND | IC1.21 26.92,41.91 26.92,39.88 30.23,36.58 30.23,28.45 LED42.GND | 71.88,24.64 71.88,20.83 LED11.GND | 71.88,24.64 74.68,27.43 LED31.GND | IC3.21 63.75,41.91 63.75,37.34 65.02,36.07 65.02,29.97 66.55,28.45 LED32.GND | 71.88,24.64 70.1,24.64 67.06,27.69 LED32.GND | IC2.21 61.21,3.81 61.21,8.38 62.48,9.65 62.48,19.81 LED12.GND | 36.32,22.86 36.32,23.62 40.13,27.43 LED41.GND 40.39,27.69 45.21,22.86 | 36.32,22.86 36.32,20.83 LED21.GND | 45.21,22.86 45.21,24.64 47.24,26.67 | 45.21,22.86 45.21,20.83 LED14.GND | 47.24,26.67 48.01,27.43 LED34.GND | 47.24,26.67 51.56,22.35 | 51.56,22.35 53.09,20.83 LED13.GND | 56.13,26.67 51.82,22.35 51.56,22.35 | 56.13,26.67 56.9,27.43 LED33.GND | 56.13,26.67 61.98,20.83 LED12.GND | LED32.GND 65.79,27.43 65.79,23.62 62.99,20.83 LED12.GND | 36.32,22.86 31.5,27.69 LED42.GND
  Bottom 0.152: IC1.21 26.92,44.45 26.92,45.72 JP6.4
XLAT  (via drill 0.25)
  Top 0.152: v35.81,41.4 38.35,38.86 53.59,38.86 55.63,40.89 55.63,41.91 IC3.24 | v74.68,41.91 80.26,36.32 80.26,9.65 78.99,8.38 68.83,8.38 65.53,5.08 65.53,4.57 65.79,4.32 66.29,4.32 67.06,3.56 68.07,3.56 IC2.24
  Bottom 0.152: IC2.24 68.07,3.56 66.29,5.33 44.96,5.33 41.91,8.38 38.61,8.38 37.34,9.65 JP1.3 | v35.81,41.4 35.81,45.47 32.77,48.51 23.11,48.51 21.84,47.24 21.84,46.99 19.3,44.45 IC1.24 | v74.68,41.91 74.68,44.2 73.66,45.21 71.12,45.21 69.6,43.69 69.6,42.16 68.83,41.4 65.79,41.4 65.02,42.16 65.02,44.2 67.06,46.23 71.12,46.23 71.63,46.74 71.63,47.75 71.12,48.26 60.45,48.26 56.39,44.2 IC3.24

### Text on the board
tPlace: SW1 | SW2 | SW3 | SIN | RGB LED Shield POV v1.1 | combee.net/rgbshield | a HTINK design | SW3 | SW2 | SW1 | SCLK | XLAT | BLANK | GSCLK